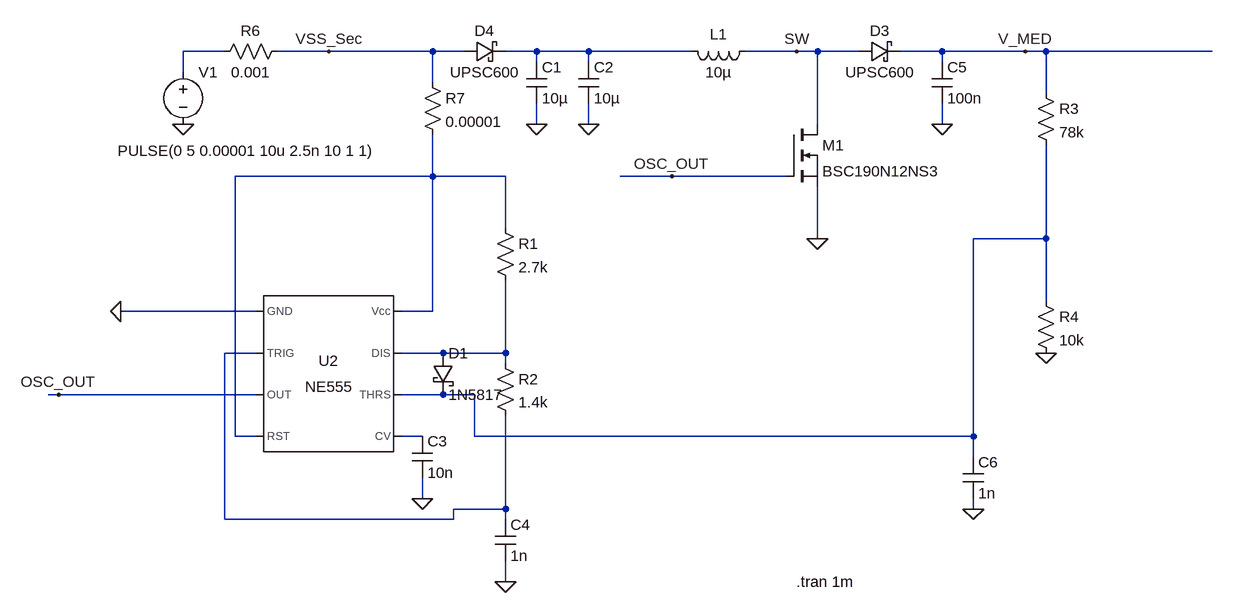
[diagram p0: schematic PWM_Controller_HV.asc]
PWM_Controller_HV.asc, the LTspice schematic file:
Version 4
SHEET 1 1748 1876
WIRE 160 -1760 96 -1760
WIRE 320 -1760 240 -1760
WIRE 480 -1760 320 -1760
WIRE 528 -1760 480 -1760
WIRE 640 -1760 592 -1760
WIRE 720 -1760 640 -1760
WIRE 880 -1760 720 -1760
WIRE 1040 -1760 960 -1760
WIRE 1072 -1760 1040 -1760
WIRE 1136 -1760 1072 -1760
WIRE 1264 -1760 1200 -1760
WIRE 1392 -1760 1264 -1760
WIRE 1424 -1760 1392 -1760
WIRE 1680 -1760 1424 -1760
WIRE 640 -1744 640 -1760
WIRE 720 -1744 720 -1760
WIRE 1264 -1744 1264 -1760
WIRE 96 -1728 96 -1760
WIRE 480 -1712 480 -1760
WIRE 1424 -1696 1424 -1760
WIRE 640 -1648 640 -1680
WIRE 720 -1648 720 -1680
WIRE 1072 -1648 1072 -1760
WIRE 1264 -1648 1264 -1680
WIRE 480 -1568 480 -1632
WIRE 480 -1568 176 -1568
WIRE 592 -1568 480 -1568
WIRE 848 -1568 768 -1568
WIRE 1024 -1568 848 -1568
WIRE 592 -1488 592 -1568
WIRE 1072 -1472 1072 -1552
WIRE 1424 -1472 1424 -1616
WIRE 1424 -1472 1312 -1472
WIRE 1424 -1376 1424 -1472
WIRE 208 -1360 0 -1360
WIRE 480 -1360 480 -1568
WIRE 480 -1360 432 -1360
WIRE 208 -1296 160 -1296
WIRE 496 -1296 432 -1296
WIRE 592 -1296 592 -1408
WIRE 592 -1296 496 -1296
WIRE 592 -1280 592 -1296
WIRE -96 -1232 -112 -1232
WIRE 208 -1232 -96 -1232
WIRE 496 -1232 432 -1232
WIRE 544 -1232 496 -1232
WIRE 176 -1168 176 -1568
WIRE 208 -1168 176 -1168
WIRE 464 -1168 432 -1168
WIRE 544 -1168 544 -1232
WIRE 1312 -1168 1312 -1472
WIRE 1312 -1168 544 -1168
WIRE 1312 -1136 1312 -1168
WIRE 464 -1072 464 -1104
WIRE 592 -1056 592 -1200
WIRE 592 -1056 512 -1056
WIRE 1312 -1056 1312 -1072
WIRE 160 -1040 160 -1296
WIRE 512 -1040 512 -1056
WIRE 512 -1040 160 -1040
WIRE 592 -1040 592 -1056
WIRE 592 -944 592 -976
FLAG 96 -1648 0
FLAG 640 -1648 0
FLAG 720 -1648 0
FLAG 320 -1760 VSS_Sec
FLAG 1040 -1760 SW
FLAG 1072 -1472 0
FLAG -96 -1232 OSC_OUT
FLAG 0 -1360 0
FLAG 464 -1072 0
FLAG 592 -944 0
FLAG 848 -1568 OSC_OUT
FLAG 1264 -1648 0
FLAG 1424 -1296 0
FLAG 1392 -1760 V_MED
FLAG 1312 -1056 0
SYMBOL voltage 96 -1744 R0
WINDOW 3 -101 137 Left 2
WINDOW 123 0 0 Left 0
WINDOW 39 0 0 Left 0
SYMATTR Value PULSE(0 5 0.00001 10u 2.5n 10 1 1)
SYMATTR InstName V1
SYMBOL cap 624 -1744 R0
SYMATTR InstName C1
SYMATTR Value 10µ
SYMBOL cap 704 -1744 R0
SYMATTR InstName C2
SYMATTR Value 10µ
SYMBOL ind 976 -1776 R90
WINDOW 0 5 56 VBottom 2
WINDOW 3 32 56 VTop 2
SYMATTR InstName L1
SYMATTR Value 10µ
SYMATTR SpiceLine Rser=100m
SYMBOL nmos 1024 -1648 R0
SYMATTR InstName M1
SYMATTR Value BSC190N12NS3
SYMBOL Misc\\NE555 320 -1264 R0
SYMATTR InstName U2
SYMBOL cap 448 -1168 R0
SYMATTR InstName C3
SYMATTR Value 10n
SYMBOL res 576 -1296 R0
SYMATTR InstName R2
SYMATTR Value 1.4k
SYMBOL cap 576 -1040 R0
SYMATTR InstName C4
SYMATTR Value 1n
SYMBOL schottky 480 -1296 R0
SYMATTR InstName D1
SYMATTR Value 1N5817
SYMATTR Description Diode
SYMATTR Type diode
SYMBOL res 576 -1504 R0
SYMATTR InstName R1
SYMATTR Value 2.7k
SYMBOL schottky 1136 -1744 R270
WINDOW 0 32 32 VTop 2
WINDOW 3 0 32 VBottom 2
SYMATTR InstName D3
SYMATTR Value UPSC600
SYMATTR Description Diode
SYMATTR Type diode
SYMBOL cap 1248 -1744 R0
SYMATTR InstName C5
SYMATTR Value 100n
SYMBOL res 1408 -1712 R0
SYMATTR InstName R3
SYMATTR Value 78k
SYMBOL res 1408 -1392 R0
SYMATTR InstName R4
SYMATTR Value 10k
SYMBOL cap 1296 -1136 R0
SYMATTR InstName C6
SYMATTR Value 1n
SYMBOL res 256 -1776 R90
WINDOW 0 0 56 VBottom 2
WINDOW 3 32 56 VTop 2
SYMATTR InstName R6
SYMATTR Value 0.001
SYMBOL res 464 -1728 R0
SYMATTR InstName R7
SYMATTR Value 0.00001
SYMBOL schottky 528 -1744 R270
WINDOW 0 32 32 VTop 2
WINDOW 3 0 32 VBottom 2
SYMATTR InstName D4
SYMATTR Value UPSC600
SYMATTR Description Diode
SYMATTR Type diode
TEXT 1040 -944 Left 2 !.tran 1m

The netlist it stands for:
* PWM_Controller_HV.asc
V1 N001 0 PULSE(0 5 0.00001 10u 2.5n 10 1 1)
C1 N002 0 10µ
C2 N002 0 10µ
L1 SW N002 10µ Rser=100m
M1 SW OSC_OUT 0 0 BSC190N12NS3
XU2 0 N005 OSC_OUT N003 N007 N004 N006 N003 NE555  ; pins GND TRIG OUT RST CV THRS DIS Vcc
C3 N007 0 10n
R2 N006 N005 1.4k
C4 N005 0 1n
D1 N006 N004 1N5817
R1 N003 N006 2.7k
D3 SW V_MED UPSC600
C5 V_MED 0 100n
R3 V_MED N004 78k
R4 N004 0 10k
C6 N004 0 1n
R6 VSS_Sec N001 0.001
R7 VSS_Sec N003 0.00001
D4 VSS_Sec N002 UPSC600
.model D D
.lib standard.dio
.model NMOS NMOS
.model PMOS PMOS
.lib standard.mos
.tran 1m
.lib NE555.sub
.backanno
.end